# Altium schematic sheet EEPROM.SchDoc
size A3
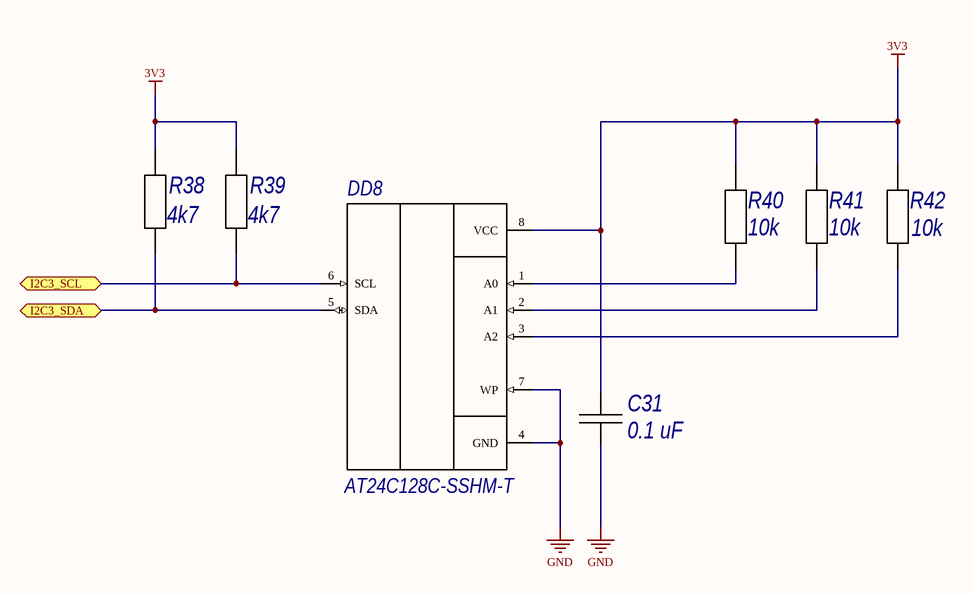
[diagram p0: EEPROM.SchDoc]

## Parts
C31  0.1 uF  [C0805C]
DD8  AT24C128C-SSHM-T  [SOIC127P600X175-8N]
R38  4k7  [C0805R]
R39  4k7  [C0805R]
R40  10k  [C0805R]
R41  10k  [C0805R]
R42  10k  [C0805R]

## Ports
I2C3_SCL (bidir), I2C3_SDA (bidir)

## Nets
3V3: C31.2 DD8.8(VCC) R38.2 R39.2 R40.2 R41.2 R42.2
GND: C31.1 DD8.4(GND) DD8.7(WP)
I2C3_SCL: DD8.6(SCL) R39.1 ; port I2C3_SCL
I2C3_SDA: DD8.5(SDA) R38.1 ; port I2C3_SDA
NetDD8_1: DD8.1(A0) R40.1
NetDD8_2: DD8.2(A1) R41.1
NetDD8_3: DD8.3(A2) R42.1

## Library data of the parts
C31 = CAP_0805: Type: Конденсатор; Published: 18.05.2010; Publisher: Andrew Danich
DD8 = AT24C128C-SSHM-T: EEPROM Memory IC 128Kb _16K x 8_ IÂ²C 1MHz 550ns 8-SOIC; MF: Microchip; MP: AT24C128C-SSHM-T; SnapEDA_Link: https://www.snapeda.com/parts/AT24C128C-SSHM-T/Microchip/view-part/1771999/?ref=snap; Value: *; Package: SO-8 Microchip; Price: None; Availability: Unavailable
R38-R42 = RES_0805: Published: 24.03.2010; Publisher: Andrew Danich; Type: Резистор